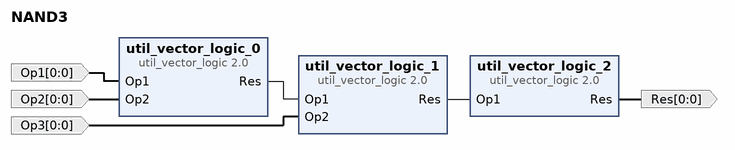
[diagram p0: block diagram of the top level]
# Vivado block design NAND3, xc7vx485tffg1157-1, Vivado 2019.1
create_bd_design NAND3

create_bd_port -dir I -from 0 -to 0 Op1
create_bd_port -dir I -from 0 -to 0 Op2
create_bd_port -dir I -from 0 -to 0 Op3
create_bd_port -dir O -from 0 -to 0 Res

create_bd_cell -type ip -vlnv xilinx.com:ip:util_vector_logic:2.0 util_vector_logic_0
set_property -dict {CONFIG.C_SIZE 1} [get_bd_cells util_vector_logic_0]
create_bd_cell -type ip -vlnv xilinx.com:ip:util_vector_logic:2.0 util_vector_logic_1
set_property -dict {CONFIG.C_SIZE 1} [get_bd_cells util_vector_logic_1]
create_bd_cell -type ip -vlnv xilinx.com:ip:util_vector_logic:2.0 util_vector_logic_2
set_property -dict {CONFIG.C_OPERATION not CONFIG.C_SIZE 1} [get_bd_cells util_vector_logic_2]

# ---- connections ----

connect_bd_net [get_bd_pins util_vector_logic_0/Res] [get_bd_pins util_vector_logic_1/Op1]
connect_bd_net -net Op1_1 [get_bd_ports Op1] [get_bd_pins util_vector_logic_0/Op1]
connect_bd_net -net Op2_1 [get_bd_ports Op2] [get_bd_pins util_vector_logic_0/Op2]
connect_bd_net -net Op3_1 [get_bd_ports Op3] [get_bd_pins util_vector_logic_1/Op2]
connect_bd_net [get_bd_pins util_vector_logic_1/Res] [get_bd_pins util_vector_logic_2/Op1]
connect_bd_net [get_bd_pins util_vector_logic_2/Res] [get_bd_ports Res]

validate_bd_design
save_bd_design
